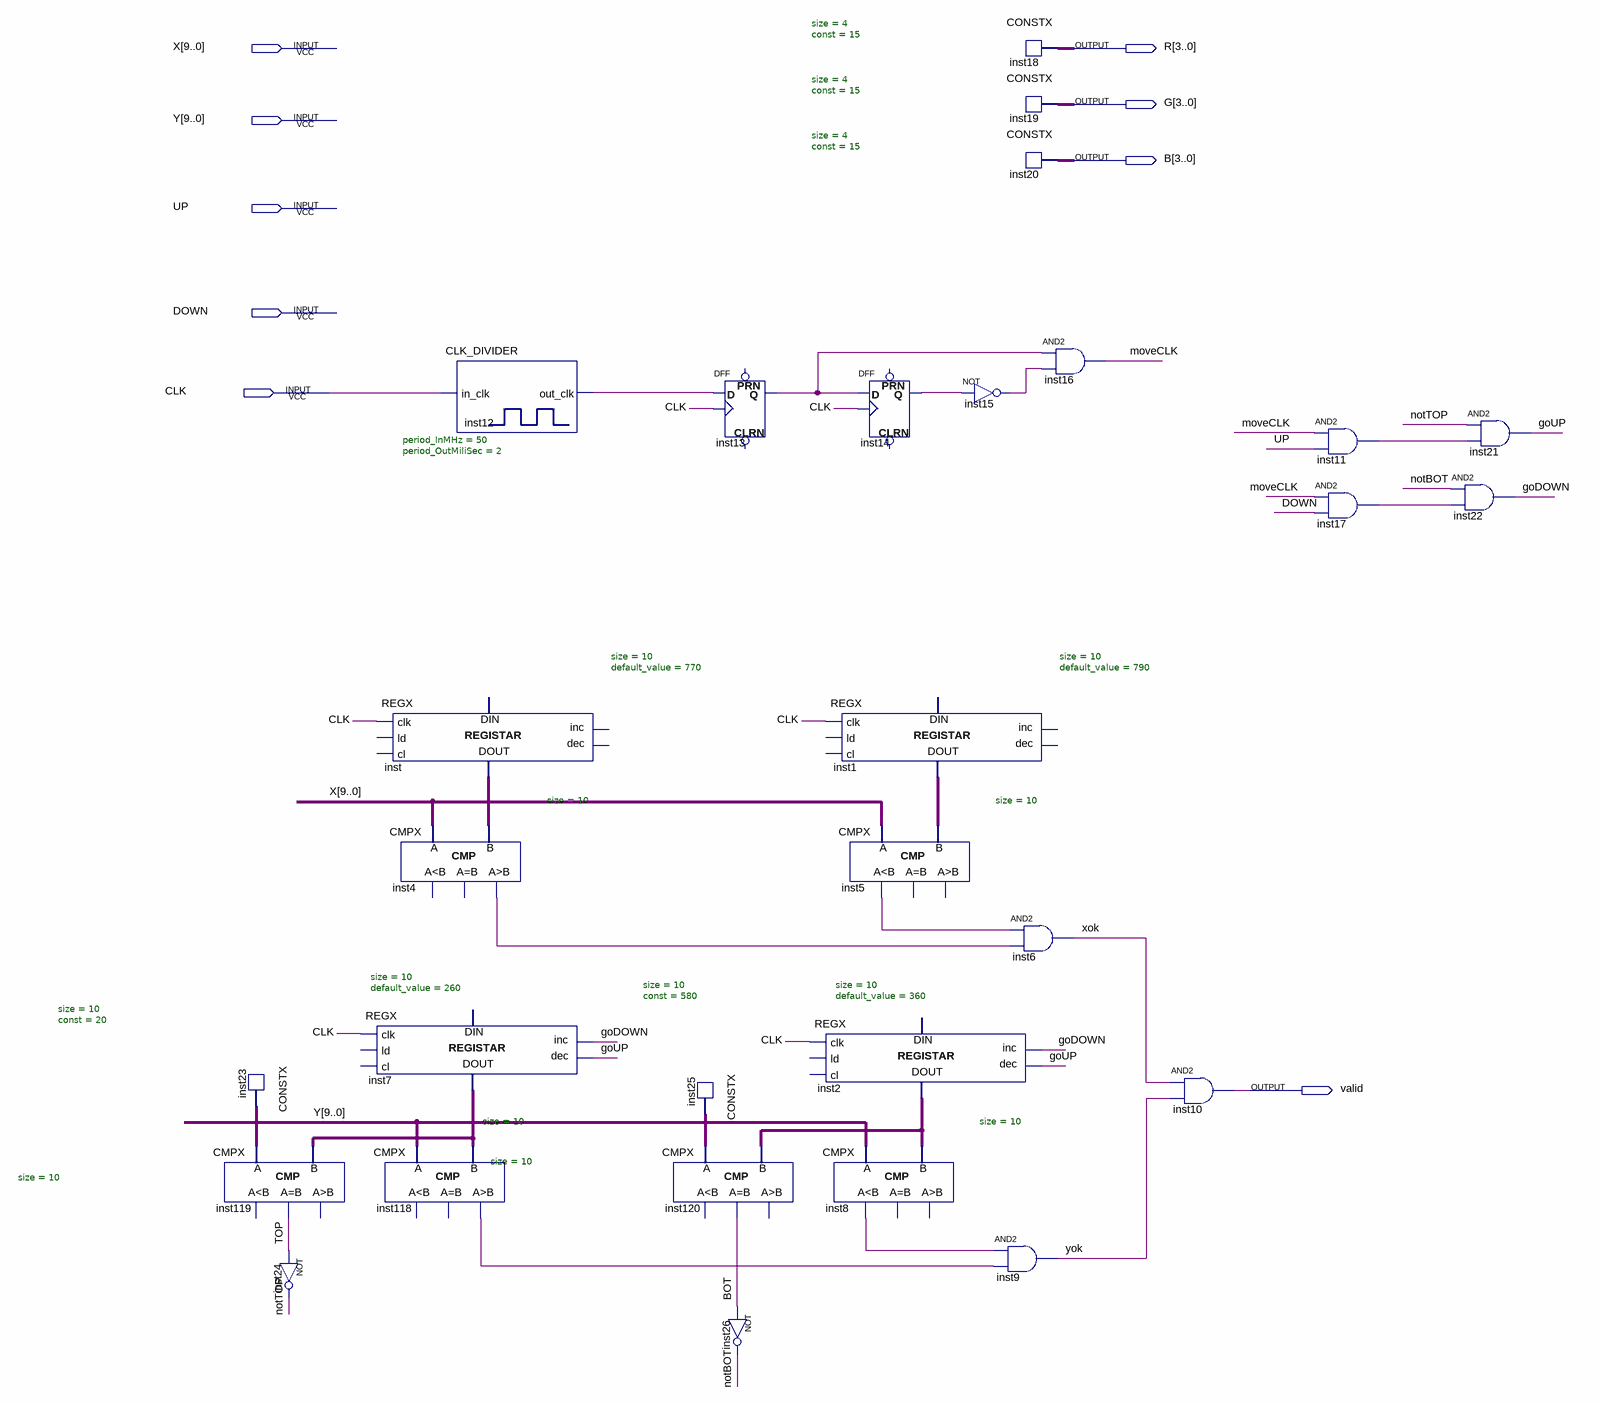
[diagram p0: schematic sheet]
// Quartus schematic Player2.bdf as structural Verilog: 29 symbols, 9 pins
module Player2 (
  input  [9:0] X,
  input  [9:0] Y,
  input  UP,
  input  DOWN,
  input  CLK,
  output [3:0] R,
  output [3:0] G,
  output [3:0] B,
  output valid
);

  wire BOT, goDOWN, goUP, inst4_gr, inst5_ls, inst8_ls, inst11_out, inst12_out_clk, inst13_q, inst14_q,
       inst15_out, inst17_out, inst118_gr, moveCLK, notBOT, notTOP, TOP, xok, yok;
  wire [9:0] inst1_data_out, inst2_data_out, inst7_data_out, inst23_data, inst25_data, inst_data_out;

  CONSTX #(.size(10), .\const (20)) inst23 (.data(inst23_data));
  CMPX #(.size(10)) inst119 (.A(inst23_data), .B(inst7_data_out), .eq(TOP));  // open: ls, gr
  not inst24 (notTOP, TOP);
  REGX #(.size(10), .default_value(770)) inst (.clk(CLK), .data_out(inst_data_out));  // open: ld, cl, inc, dec, data_in
  CMPX #(.size(10)) inst4 (.A(X), .B(inst_data_out), .gr(inst4_gr));  // open: ls, eq
  REGX #(.size(10), .default_value(260)) inst7 (
    .clk(CLK), .inc(goDOWN), .dec(goUP), .data_out(inst7_data_out));  // open: ld, cl, data_in
  CMPX #(.size(10)) inst118 (.A(Y), .B(inst7_data_out), .gr(inst118_gr));  // open: ls, eq
  CLK_DIVIDER #(.period_InMHz(50), .period_OutMiliSec(2)) inst12 (.in_clk(CLK), .out_clk(inst12_out_clk));
  CONSTX #(.size(10), .\const (580)) inst25 (.data(inst25_data));
  CMPX #(.size(10)) inst120 (.A(inst25_data), .B(inst2_data_out), .eq(BOT));  // open: ls, gr
  DFF inst13 (.CLK(CLK), .D(inst12_out_clk), .Q(inst13_q));  // open: CLRN, PRN
  not inst26 (notBOT, BOT);
  REGX #(.size(10), .default_value(790)) inst1 (
    .clk(CLK), .data_out(inst1_data_out));  // open: ld, cl, inc, dec, data_in
  CMPX #(.size(10)) inst5 (.A(X), .B(inst1_data_out), .ls(inst5_ls));  // open: eq, gr
  REGX #(.size(10), .default_value(360)) inst2 (
    .clk(CLK), .inc(goDOWN), .dec(goUP), .data_out(inst2_data_out));  // open: ld, cl, data_in
  CMPX #(.size(10)) inst8 (.A(Y), .B(inst2_data_out), .ls(inst8_ls));  // open: eq, gr
  DFF inst14 (.CLK(CLK), .D(inst13_q), .Q(inst14_q));  // open: CLRN, PRN
  not inst15 (inst15_out, inst14_q);
  CONSTX #(.size(4), .\const (15)) inst18 (.data(R));
  CONSTX #(.size(4), .\const (15)) inst19 (.data(G));
  CONSTX #(.size(4), .\const (15)) inst20 (.data(B));
  and inst6 (xok, inst5_ls, inst4_gr);
  and inst9 (yok, inst8_ls, inst118_gr);
  and inst16 (moveCLK, inst13_q, inst15_out);
  and inst10 (valid, xok, yok);
  and inst11 (inst11_out, moveCLK, UP);
  and inst17 (inst17_out, moveCLK, DOWN);
  and inst21 (goUP, notTOP, inst11_out);
  and inst22 (goDOWN, notBOT, inst17_out);
endmodule
